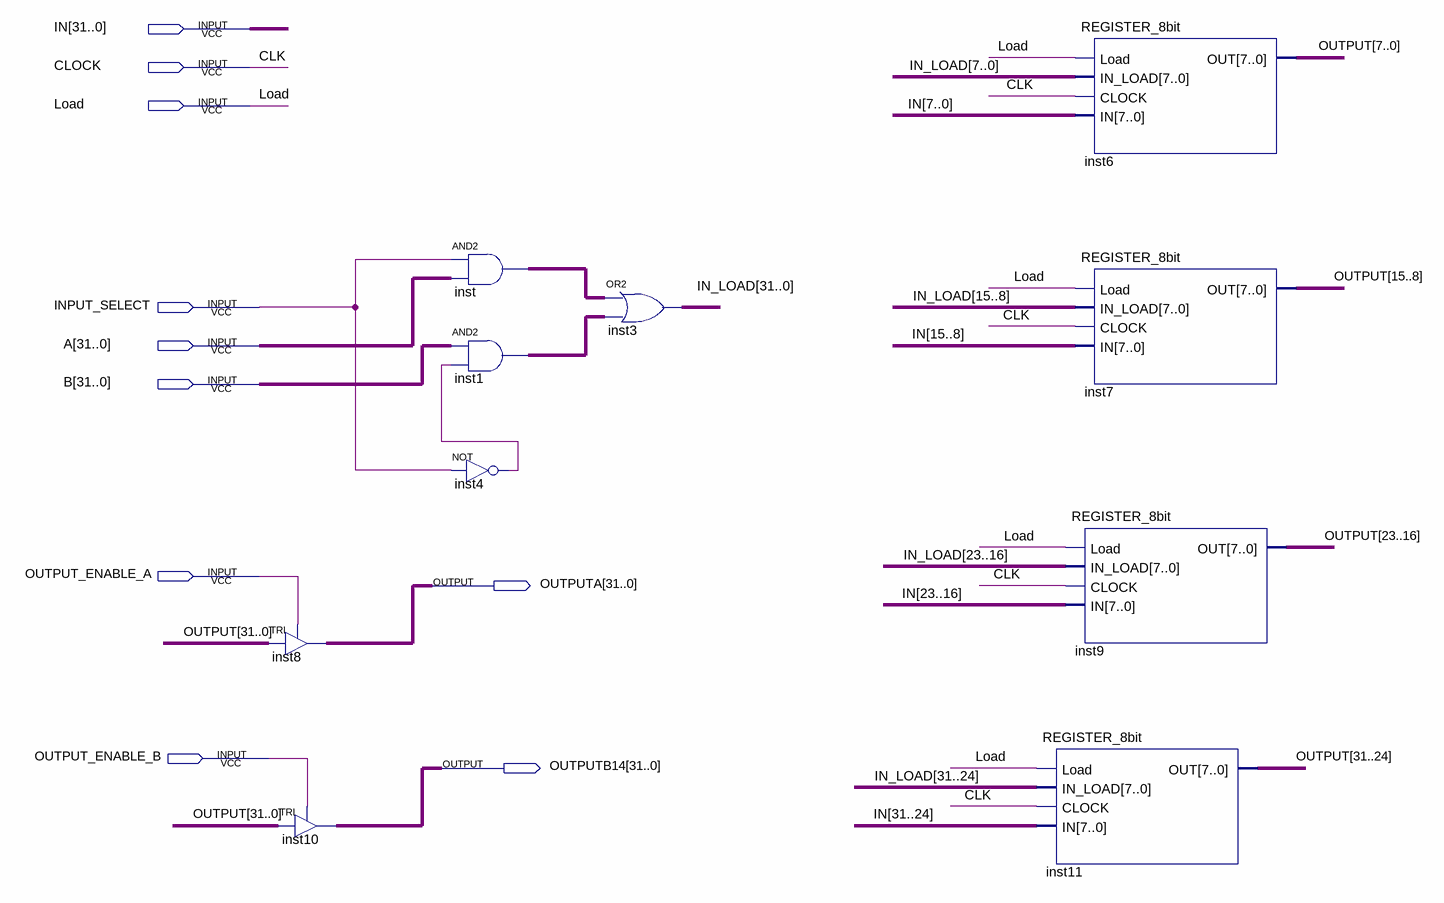
[diagram p0: schematic sheet]
// Quartus schematic REGISTER_32bit.bdf as structural Verilog: 10 symbols, 10 pins
module REGISTER_32bit (
  input  [31:0] IN,
  input  CLOCK,
  input  Load,
  input  INPUT_SELECT,
  input  [31:0] A,
  input  [31:0] B,
  input  OUTPUT_ENABLE_A,
  input  OUTPUT_ENABLE_B,
  output [31:0] OUTPUTA,
  output [31:0] OUTPUTB14
);

  wire inst4_out;
  wire [31:0] IN_LOAD, inst1_out, inst_out, OUTPUT;

  TRI inst8[31:0] (.IN(OUTPUT), .OE(OUTPUT_ENABLE_A), .OUT(OUTPUTA));
  TRI inst10[31:0] (.IN(OUTPUT), .OE(OUTPUT_ENABLE_B), .OUT(OUTPUTB14));
  assign inst_out = {32{INPUT_SELECT}} & A;  // AND2 inst, 32 bits wide
  assign inst1_out = B & {32{inst4_out}};  // AND2 inst1, 32 bits wide
  not inst4 (inst4_out, INPUT_SELECT);
  assign IN_LOAD = inst_out | inst1_out;  // OR2 inst3, 32 bits wide
  REGISTER_8bit inst6 (.Load(Load), .IN_LOAD(IN_LOAD[7:0]), .CLOCK(CLOCK), .IN(IN[7:0]), .OUT(OUTPUT[7:0]));
  REGISTER_8bit inst7 (.Load(Load), .IN_LOAD(IN_LOAD[15:8]), .CLOCK(CLOCK), .IN(IN[15:8]), .OUT(OUTPUT[15:8]));
  REGISTER_8bit inst9 (.Load(Load), .IN_LOAD(IN_LOAD[23:16]), .CLOCK(CLOCK), .IN(IN[23:16]), .OUT(OUTPUT[23:16]));
  REGISTER_8bit inst11 (.Load(Load), .IN_LOAD(IN_LOAD[31:24]), .CLOCK(CLOCK), .IN(IN[31:24]), .OUT(OUTPUT[31:24]));

  // Other names for the same wires on the sheet: CLK = CLOCK
endmodule
